# EAGLE design rpi_board (EAGLE 7.6.0)
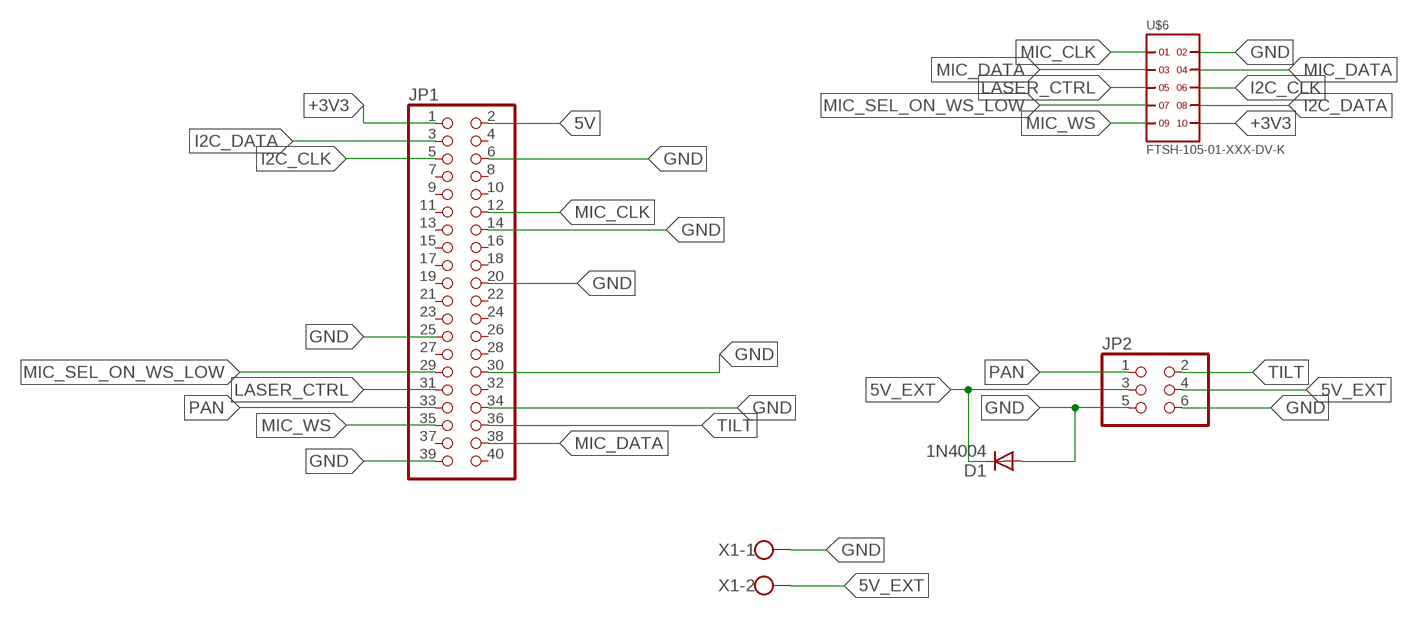
[diagram p0: schematic, sheet 1]

## Parts
D1  1N4004  [DO41-10]
JP1  PINHD-2X20  [2X20]
JP2  PINHD-2X3  [2X03]
U$6  FTSH-105-01-XXX-DV-K  [FTSH-105-01-XXX-DV-K]
X1  W237-102  [W237-102]

## Nets
5V: JP1.2
5V_EXT: D1.C JP2.3 JP2.4 X1.2
+3V3 [pwr]: JP1.1 U$6.10
GND [pwr]: D1.A JP1.6 JP1.14 JP1.20 JP1.25 JP1.30 JP1.34 JP1.39 JP2.5 JP2.6 U$6.2 X1.1
I2C_CLK: JP1.5 U$6.6
I2C_DATA: JP1.3 U$6.8
LASER_CTRL: JP1.31 U$6.5
MIC_CLK: JP1.12 U$6.1
MIC_DATA: JP1.38 U$6.3 U$6.4
MIC_SEL_ON_WS_LOW: JP1.29 U$6.7
MIC_WS: JP1.35 U$6.9
PAN: JP1.33 JP2.1
TILT: JP1.36 JP2.2
Unconnected: JP1.4 JP1.7 JP1.8 JP1.9 JP1.10 JP1.11 JP1.13 JP1.15 JP1.16 JP1.17 JP1.18 JP1.19 JP1.21 JP1.22 JP1.23 JP1.24 JP1.26 JP1.27 JP1.28 JP1.32 JP1.37 JP1.40

## Library data of the parts
D1 = diode:1N4004: DIODE general purpose rectifier, 1 A
JP1 = pinhead:PINHD-2X20: PIN HEADER
JP2 = pinhead:PINHD-2X3: PIN HEADER
U$6 = samtec:FTSH-105-01-XXX-DV-K
X1 = con-wago-500:W237-102: WAGO SCREW CLAMP; MPN: 237-102; OC_FARNELL: unknown; OC_NEWARK: 70K9898

## Net classes
0 signal: width 0.508 mm, drill 0.889 mm, clearance 0.254 mm
1 pwr: width 1.016 mm, drill 0.889 mm, clearance 1.016 mm

## Board
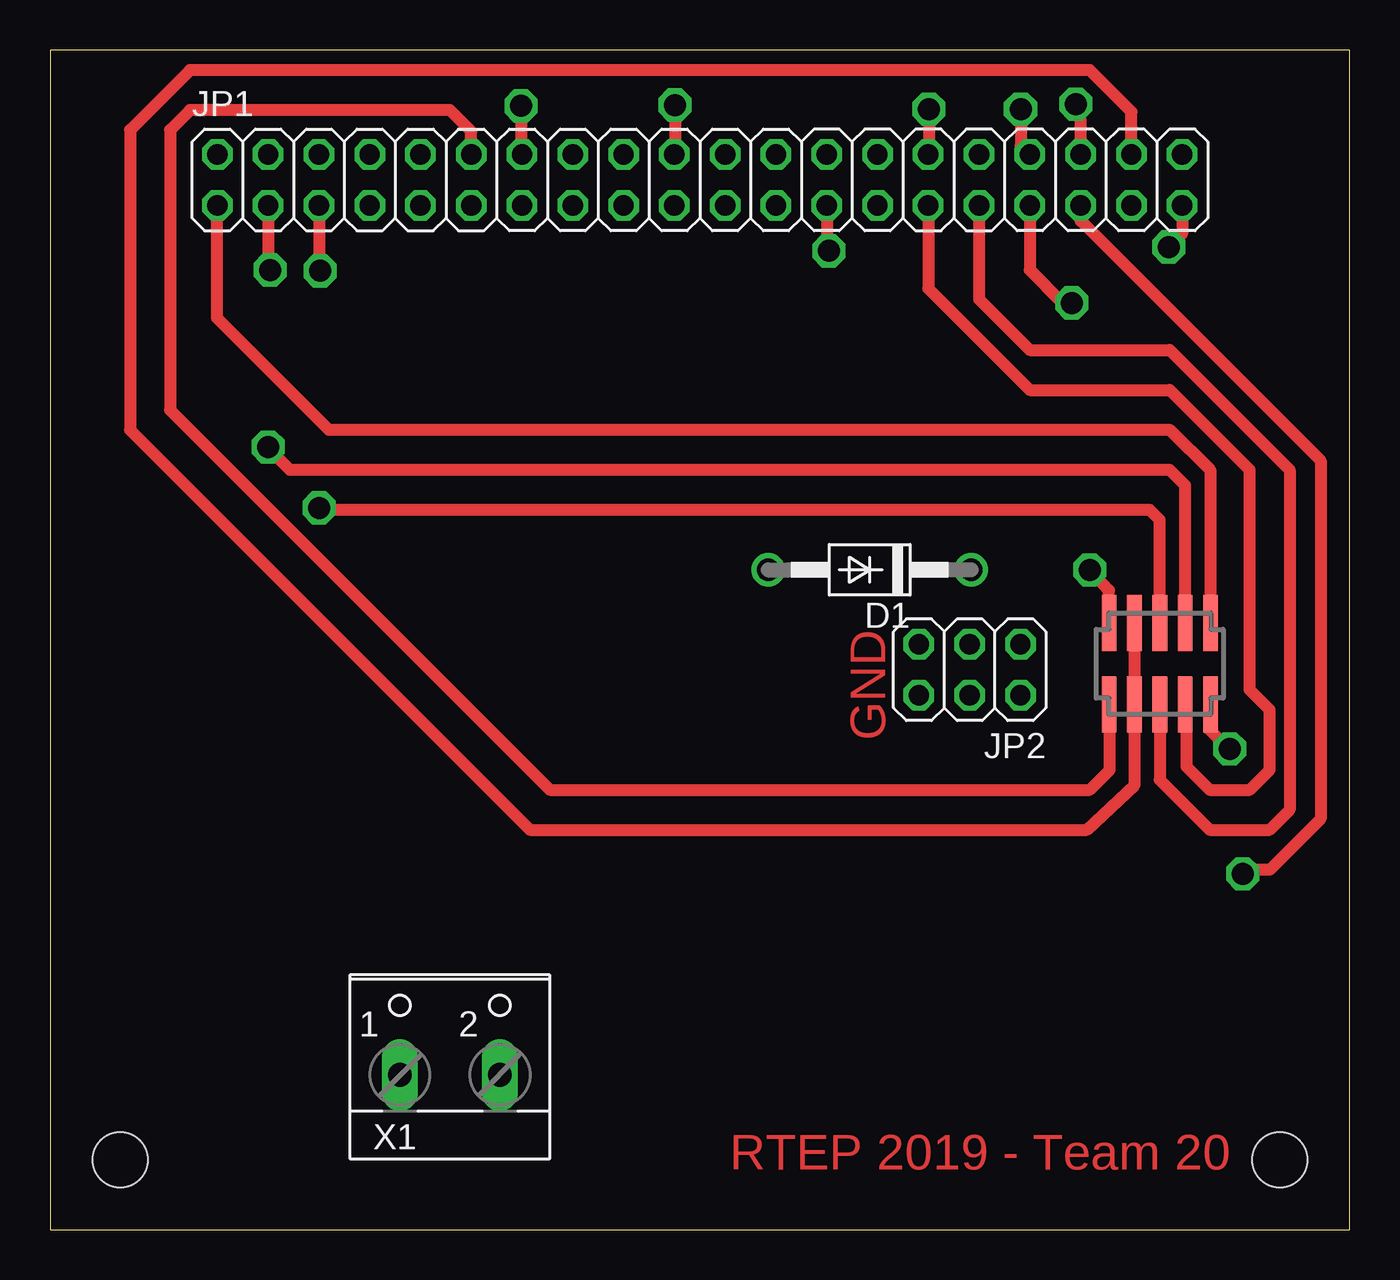
[diagram p1: board, top side]
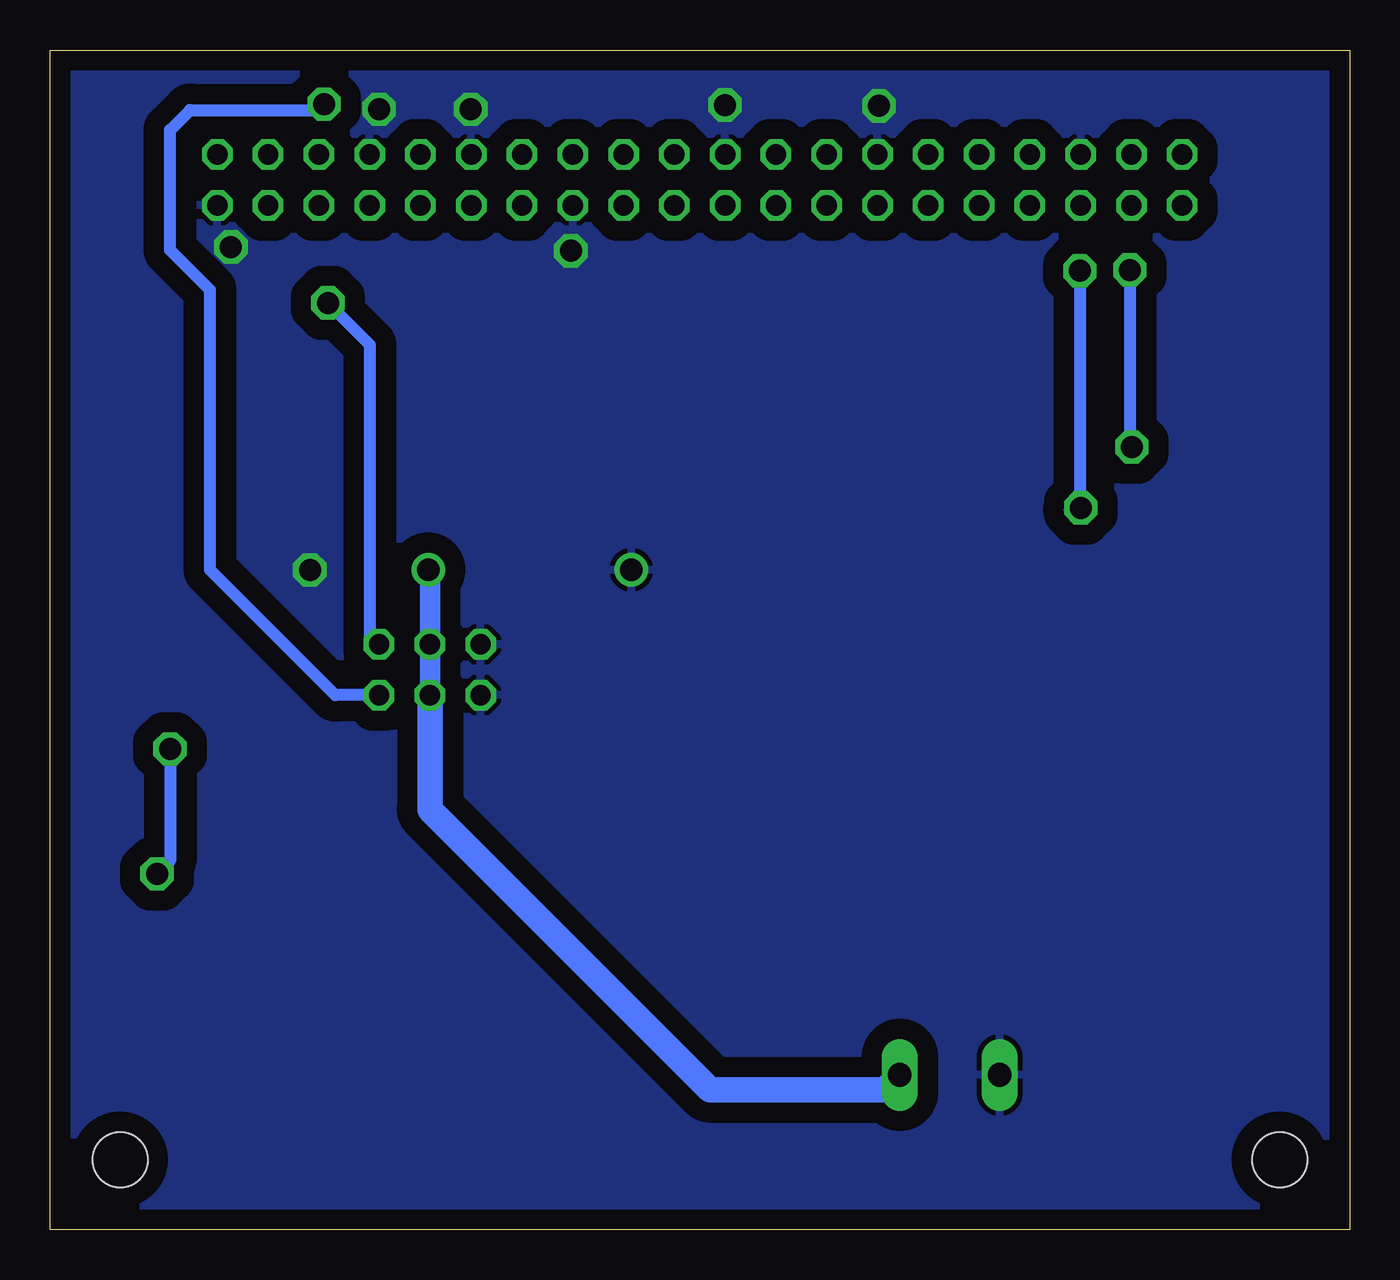
[diagram p2: board, bottom side, seen from below]

Size 65 x 59 mm. Coordinates in mm from the lower left corner, seen from the top.
Outline: 0,0 65,0 65,59 0,59 0,0
Copper layers (1*16): Top 0.035mm / dielectric 1.5mm / Bottom 0.035mm
Design rules "default": minimum track width 10mil, minimum drill 24mil, track to track 8mil, track to pad 8mil, pad to pad 8mil, via to via 8mil, smd to smd 8mil, copper to edge 40mil, drill to drill 8mil, minimum pad ring 10mil, minimum via ring 8mil, stop-mask expansion 4mil, vias tented up to drill 0mil, thermal gap 10mil
Holes 2.75 mm at 3.5,3.5 61.5,3.5

### Footprints (pad centres in the part's own frame; a part is rotated, then mirrored left to right if it is on the bottom)
DO41-10 = drill 1.118: A 5.08,0; C -5.08,0
2X20 = drill 1.016 octagon: 1 -24.13,-1.27; 2 -24.13,1.27; 3 -21.59,-1.27; 4 -21.59,1.27; 5 -19.05,-1.27; 6 -19.05,1.27; 7 -16.51,-1.27; 8 -16.51,1.27; 9 -13.97,-1.27; 10 -13.97,1.27; 11 -11.43,-1.27; 12 -11.43,1.27; 13 -8.89,-1.27; 14 -8.89,1.27; 15 -6.35,-1.27; 16 -6.35,1.27; 17 -3.81,-1.27; 18 -3.81,1.27; 19 -1.27,-1.27; 20 -1.27,1.27; 21 1.27,-1.27; 22 1.27,1.27; 23 3.81,-1.27; 24 3.81,1.27; 25 6.35,-1.27; 26 6.35,1.27; 27 8.89,-1.27; 28 8.89,1.27; 29 11.43,-1.27; 30 11.43,1.27; 31 13.97,-1.27; 32 13.97,1.27; 33 16.51,-1.27; 34 16.51,1.27; 35 19.05,-1.27; 36 19.05,1.27; 37 21.59,-1.27; 38 21.59,1.27; 39 24.13,-1.27; 40 24.13,1.27
2X03 = drill 1.016 octagon: 1 -2.54,-1.27; 2 -2.54,1.27; 3 0,-1.27; 4 0,1.27; 5 2.54,-1.27; 6 2.54,1.27
FTSH-105-01-XXX-DV-K = smd 0.737 x 2.794: 1 -2.54,-2.032; 2 -2.54,2.032; 3 -1.27,-2.032; 4 -1.27,2.032; 5 0,-2.032; 6 0,2.032; 7 1.27,-2.032; 8 1.27,2.032; 9 2.54,-2.032; 10 2.54,2.032
W237-102 = drill 1.194 long: 1 -2.5,-1.27; 2 2.5,-1.27

### Placement (x,y rotation side)
D1  41,33 180 top
JP1  32.5,52.5 0 top
JP2  46,28 180 top
U$6  55.51,28.3 0 top
X1  20,9 0 top

### Tracks (layer width: path | path; a pad name or v marks a point on that pad's centre or on a via)
5V_EXT
  Bottom 1.016: D1.C 46,32.92 JP2.3 JP2.4
  Bottom 1.27: JP2.4 46,21 32,7 23.23,7 X1.2
+3V3
  Top 0.61: U$6.10 58.05,37.95 56,40 13.95,40 8.35,45.6 8.35,51.21 JP1.1
GND  (via drill 1.1)
  Top 0.61: U$6.2 52.97,31.97 v52,33 | v23.55,56.2 23.55,53.83 JP1.14 | v31.25,56.25 31.25,53.79 JP1.20 | v43.95,56.05 43.95,53.79 JP1.30 | JP1.39 56.63,49.83 v55.95,49.15 | JP1.25 38.85,49.05 v38.95,48.95 | v48.55,56.05 48.55,54.23 JP1.34
  pour Bottom: 0,59 65,59 65,0 0,0
I2C_CLK  (via drill 1.1)
  Top 0.61: U$6.6 55.51,35.49 55,36 13.65,36 13.6,36.05 13.5,36.05 v13.45,36.1 | JP1.5 13.45,48 v13.5,47.95
  Bottom 0.61: v13.5,47.95 13.5,36.5 14,36 13.55,36 v13.45,36.1
I2C_DATA  (via drill 1.1)
  Top 0.61: U$6.8 56.78,37.22 56,38 12,38 10.9,39.1 v10.9,39.15 | JP1.3 10.91,48.09 v11,48
  Bottom 0.61: v11,48 11,39.25 v10.9,39.15
LASER_CTRL
  Top 0.61: U$6.5 55.51,22.49 58,20 61,20 62,21 62,38 56,44 49,44 46.47,46.53 JP1.31
MIC_CLK
  Top 0.61: JP1.12 21.07,54.93 20,56 7,56 6,55 6,41 6.5,40.5 25,22 52,22 53,23 53,26.24 U$6.1
MIC_DATA
  Top 0.61: U$6.4 U$6.3 54.25,25.81 54.25,22.25 51.85,20 24,20 4,40 4,55 7,58 52,58 54.09,55.91 JP1.38
MIC_SEL_ON_WS_LOW
  Top 0.61: JP1.29 43.93,47.07 49,42 56,42 60,38 60,27 61,26 61,23 60,22 58,22 56.85,23.15 56.85,26.2 U$6.7
MIC_WS  (via drill 1.1)
  Top 0.61: JP1.35 51.55,50.45 63.55,38.45 63.55,20.55 61,18 60,18 59.8,17.8 v59.65,17.8 | v59,24.05 58.95,24.05 58,25 58,26.22 U$6.9
  Bottom 0.61: v59,24.05 59,18.45 v59.65,17.8
PAN  (via drill 1.1)
  Top 0.61: JP1.33 49.01,48.01 50.67,46.35 v51.1,46.35
  Bottom 0.61: JP2.1 49,29.73 49,44.25 v51.1,46.35
TILT  (via drill 1.1)
  Top 0.61: JP1.36 51.55,55.45 51.35,56.2 v51.3,56.3 51.4,56.4
  Bottom 0.61: JP2.2 50.73,26.73 57,33 57,47 59,49 59,55 58,56 51.6,56 v51.3,56.3

### Text on the board
Top: GND | RTEP 2019 - Team 20